# EAGLE design Adapter-IO4-test (EAGLE 7.7.0)
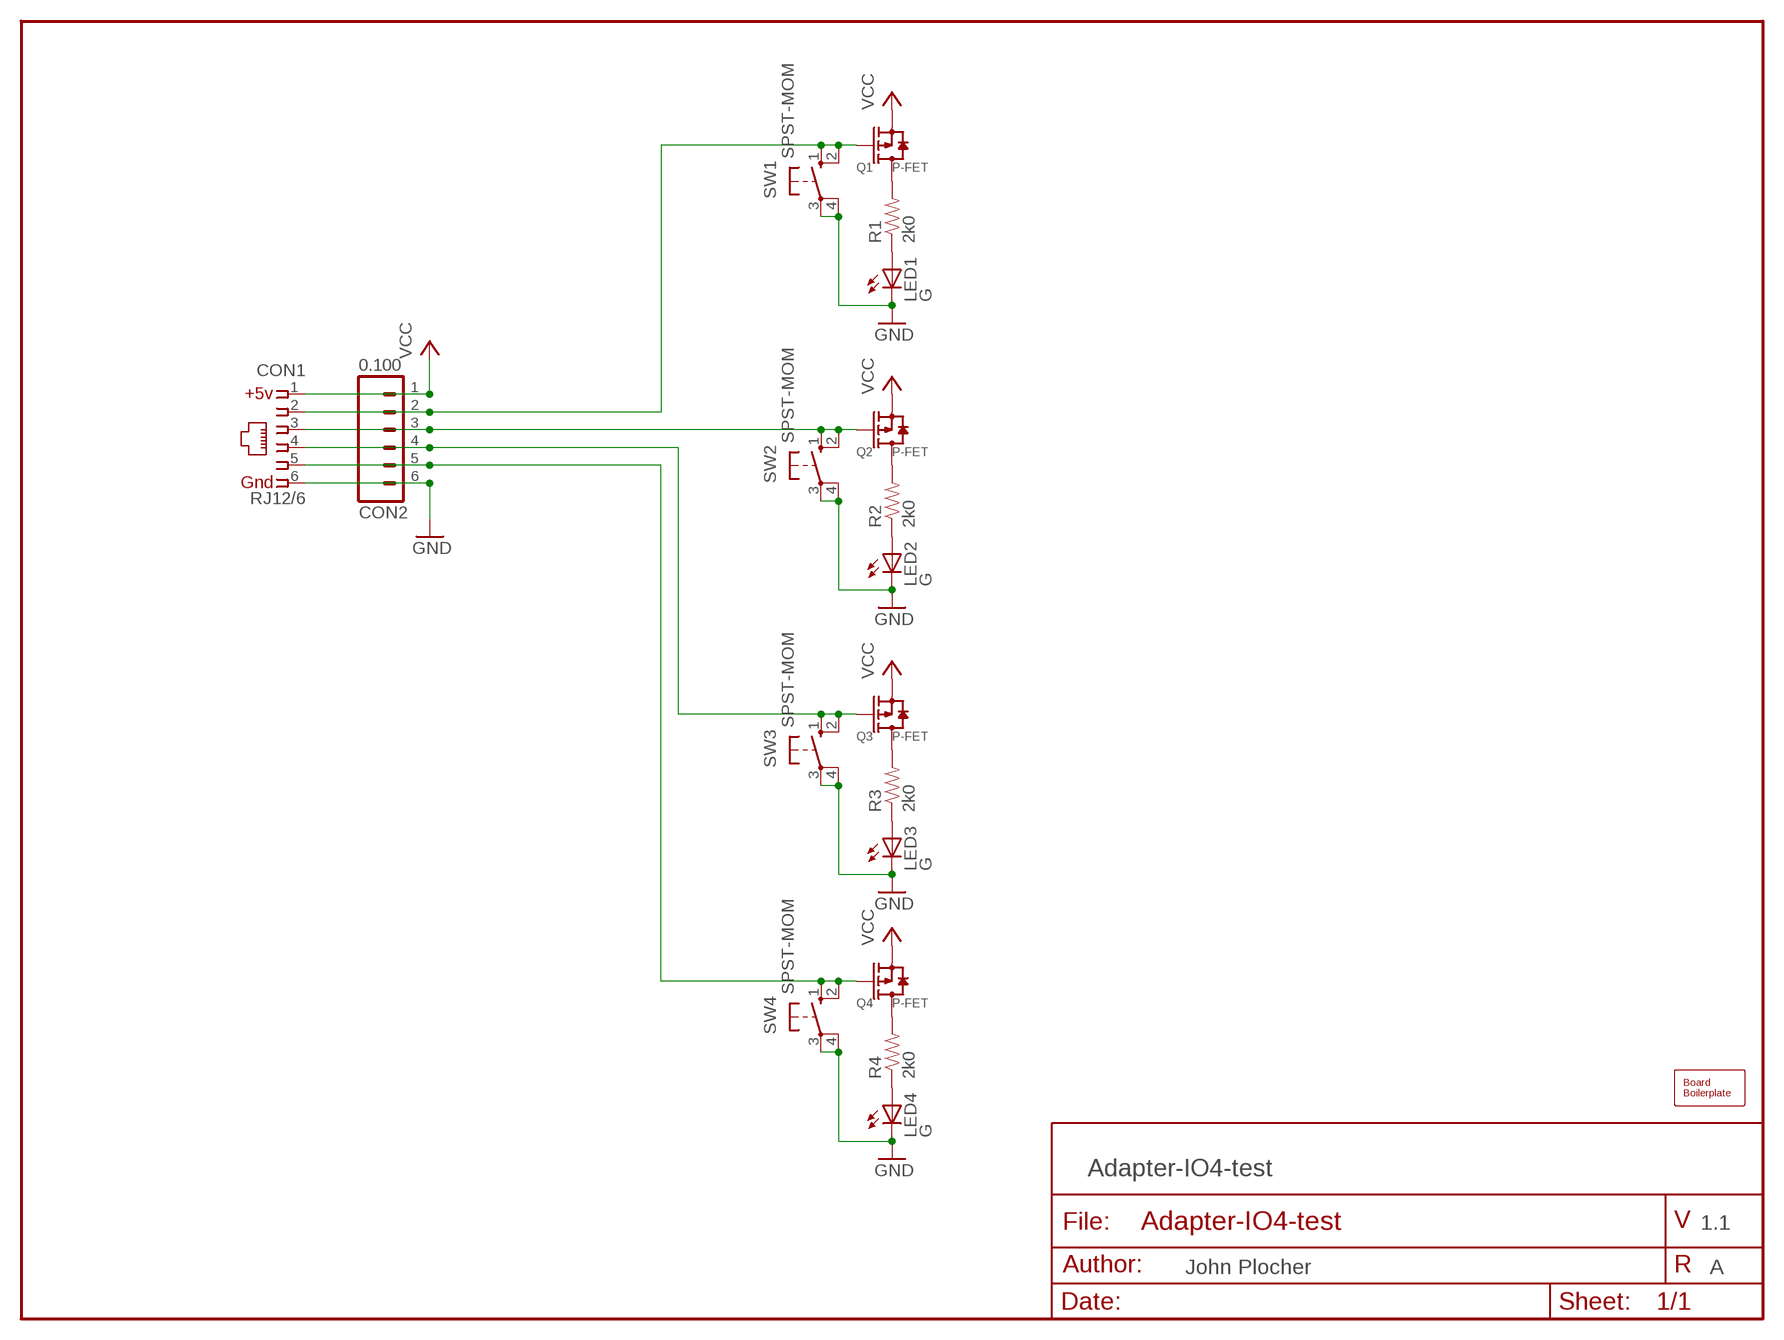
[diagram p0: schematic, sheet 1]

## Parts
BOARD1  BOARD50X50-NOHOLES  [BOARD-SEEED5X5-NOHOLES]
CON1  RJ12/6  CONNECTOR-IO4INV  [RJ25-INVERTED]
CON2  0.100  CONNECTOR-M06LOCK  [1X06_LOCK]
LED1  G  LED0603-LED  [0603-LED]
LED2  G  LED0603-LED  [0603-LED]
LED3  G  LED0603-LED  [0603-LED]
LED4  G  LED0603-LED  [0603-LED]
Q1  P-FET  MOSFET-P  [SOT23-3]
Q2  P-FET  MOSFET-P  [SOT23-3]
Q3  P-FET  MOSFET-P  [SOT23-3]
Q4  P-FET  MOSFET-P  [SOT23-3]
R1  2k0  R0603-RES  [0603-RES]
R2  2k0  R0603-RES  [0603-RES]
R3  2k0  R0603-RES  [0603-RES]
R4  2k0  R0603-RES  [0603-RES]
SW1  SPST-MOM  SWITCH-10-XX  [B3F-10XX]
SW2  SPST-MOM  SWITCH-10-XX  [B3F-10XX]
SW3  SPST-MOM  SWITCH-10-XX  [B3F-10XX]
SW4  SPST-MOM  SWITCH-10-XX  [B3F-10XX]

## Nets
GND: CON1.6 CON2.6 LED1.C LED2.C LED3.C LED4.C SW1.3(P) SW1.4(P1) SW2.3(P) SW2.4(P1) SW3.3(P) SW3.4(P1) SW4.3(P) SW4.4(P1)
N$1: Q1.3(D) R1.2
N$2: LED1.A R1.1
N$3: Q2.3(D) R2.2
N$4: LED2.A R2.1
N$5: Q3.3(D) R3.2
N$6: LED3.A R3.1
N$7: CON1.2 CON2.2 Q1.1(G) SW1.1(S) SW1.2(S1)
N$8: CON1.3 CON2.3 Q2.1(G) SW2.1(S) SW2.2(S1)
N$9: CON1.4 CON2.4 Q3.1(G) SW3.1(S) SW3.2(S1)
N$10: CON1.5 CON2.5 Q4.1(G) SW4.1(S) SW4.2(S1)
N$15: Q4.3(D) R4.2
N$16: LED4.A R4.1
VCC: CON1.1 CON2.1 Q1.2(S) Q2.2(S) Q3.2(S) Q4.2(S)

## Notes on the sheet
- 1.1
- John Plocher | A

## Library data of the parts
BOARD1 = SPCoast:BOARD
CON1 = SPCoast:CONNECTOR-IO4
CON2 = SPCoast:CONNECTOR-M06: Header 6 Standard 6-pin 0.1" header
LED1-LED4 = SPCoast:LED*
Q1-Q4 = SPCoast:MOSFET-P: CJ2305：SMD MOSFET P-CH 8V-4.1A
R1-R4 = SPCoast:R*: Resistor Basic schematic elements and footprints for 0603, 1206, and PTH 1/10th watt (small) resistors.
SW1-SW4 = SPCoast:SWITCH-10-XX: OMRON SWITCH

## Board
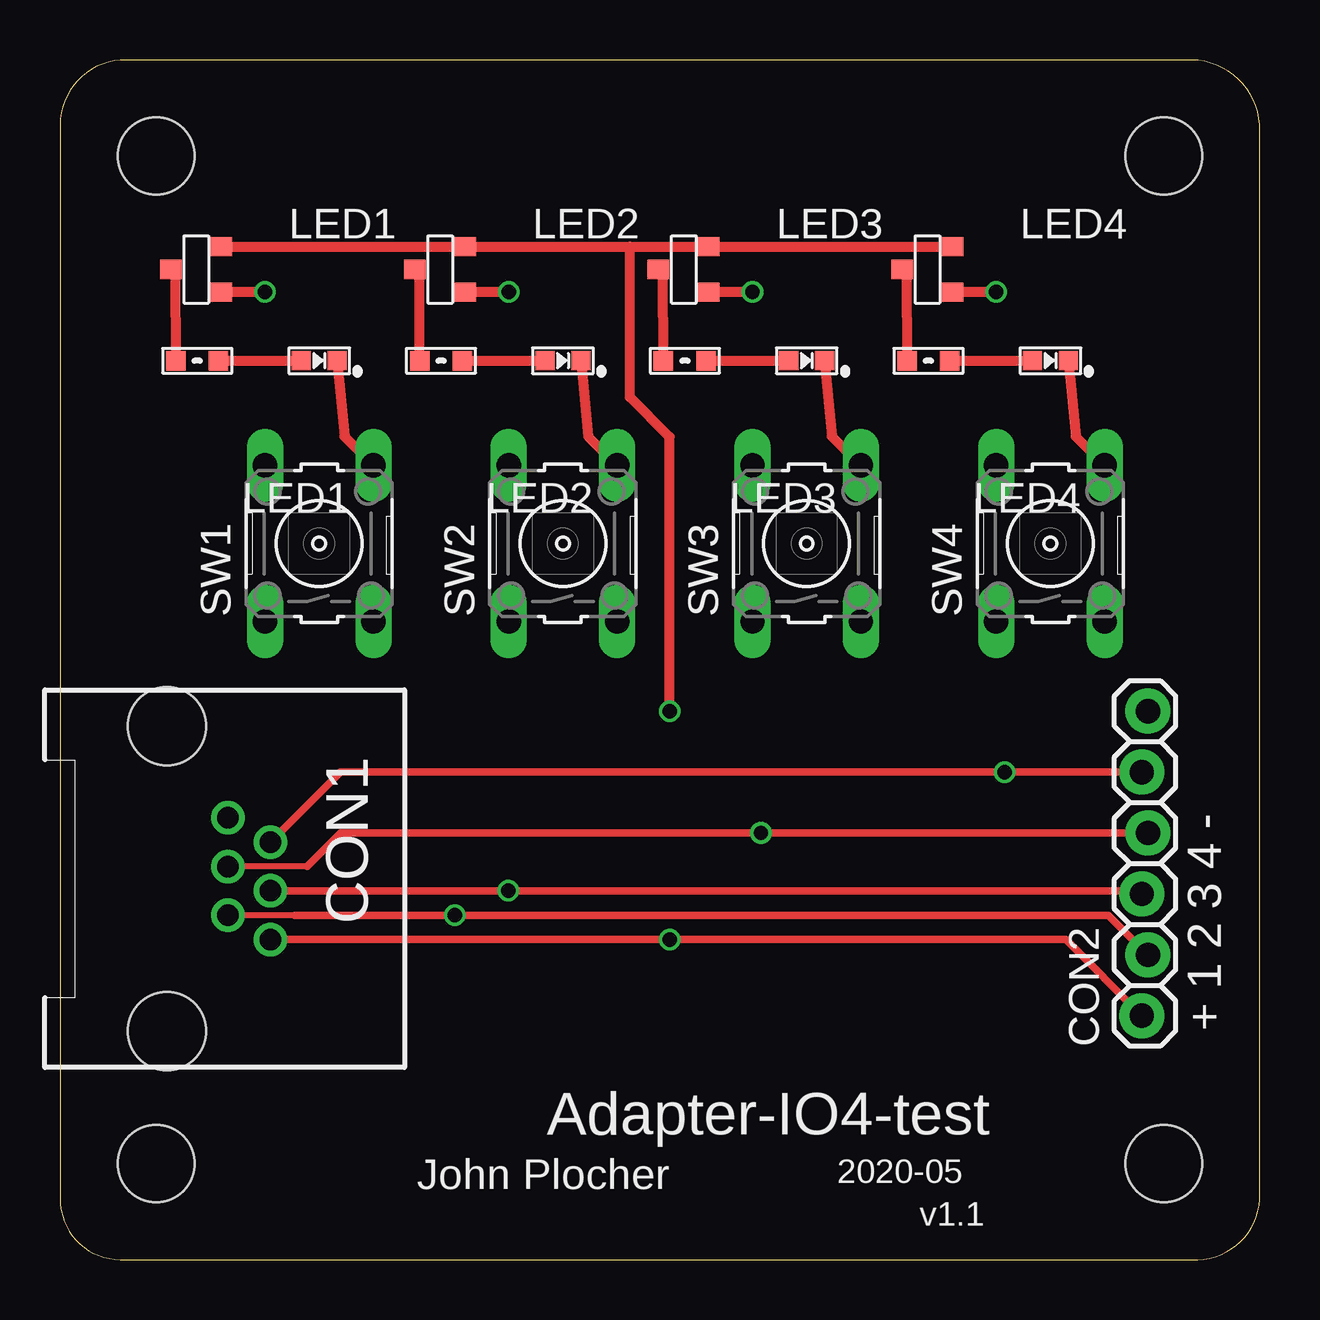
[diagram p1: board, top side]
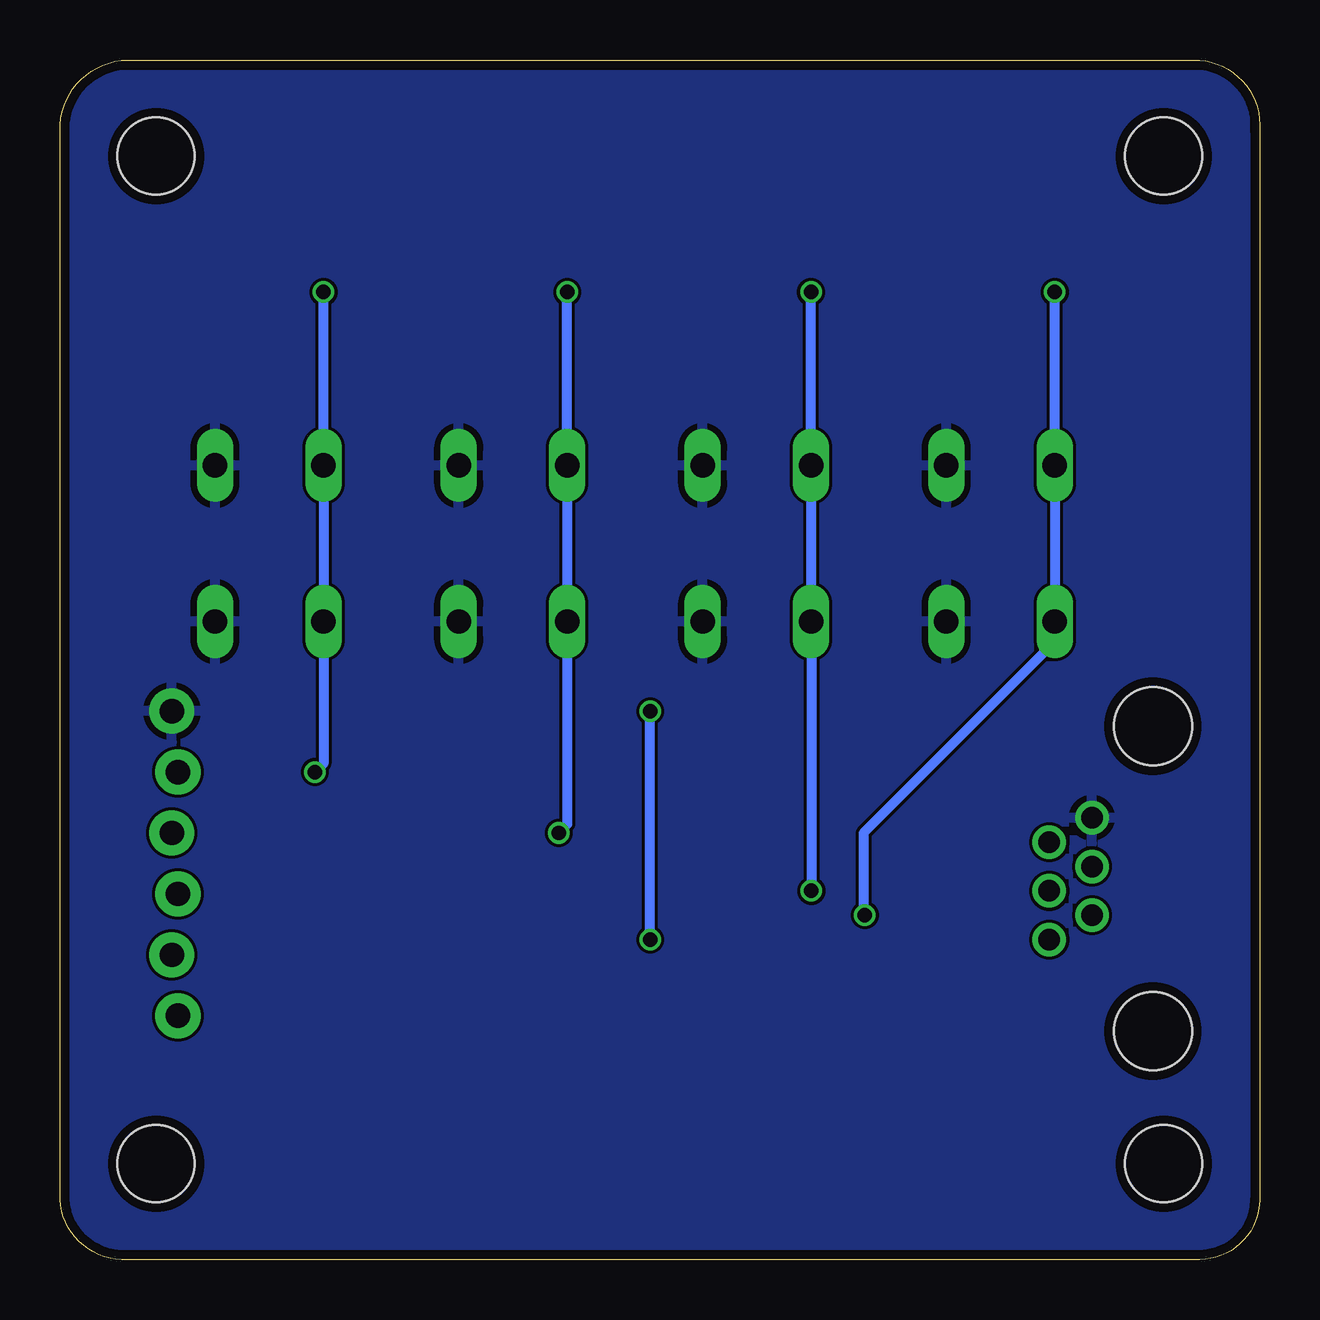
[diagram p2: board, bottom side, seen from below]

Size 50.01 x 50 mm. Coordinates in mm from the lower left corner, seen from the top.
Copper layers (1*16): Top 0.035mm / dielectric 1.5mm / Bottom 0.035mm
Design rules "default *": minimum track width 5mil, minimum drill 0.2mm, track to track 5mil, track to pad 5mil, pad to pad 5mil, via to via 5mil, smd to smd 5mil, copper to edge 0.4mm, drill to drill 5mil, minimum pad ring 3mil, minimum via ring 3mil, stop-mask expansion 4mil, vias tented up to drill 0mil, thermal gap 10mil
Holes 3.2 mm at 46.01,46 4.01,4 46.01,4 4.01,46

### Footprints (pad centres in the part's own frame; a part is rotated, then mirrored left to right if it is on the bottom)
RJ25-INVERTED = drill 0.9 pad 1.4: 1 2.54,4.318; 2 1.524,2.54; 3 0.508,4.318; 4 -0.508,2.54; 5 -1.524,4.318; 6 -2.54,2.54 | hole 3.251: -6.35,0; 6.35,0
1X06_LOCK = drill 1.016 pad 1.88: 1 0,0; 2 2.54,-0.254; 3 5.08,0; 4 7.62,-0.254; 5 10.16,0; 6 12.7,-0.254
0603-LED = smd 0.8 x 0.8: A 0.75,0; C -0.75,0
SOT23-3 = smd 0.9 x 0.8: 1 1,-0.95; 2 1,0.95; 3 -1.1,0
0603-RES = smd 0.813 x 0.813: 1 -0.889,0; 2 0.889,0
B3F-10XX = drill 1.016 long: 1 -3.251,2.261; 2 3.251,2.261; 3 -3.251,-2.261; 4 3.251,-2.261

### Placement (x,y rotation side)
BOARD1  0.01,0 0 top
CON1  4.45,15.88 270 top
CON2  45.09,10.16 90 top
LED1  10.8,37.47 180 top
LED2  20.96,37.47 180 top
LED3  31.12,37.47 180 top
LED4  41.28,37.47 180 top
Q1  5.72,41.28 0 top
Q2  15.88,41.28 0 top
Q3  26.04,41.28 0 top
Q4  36.2,41.28 0 top
R1  5.72,37.47 180 top
R2  15.88,37.47 180 top
R3  26.04,37.47 180 top
R4  36.2,37.47 180 top
SW1  10.8,29.85 90 top
SW2  20.96,29.85 90 top
SW3  31.12,29.85 90 top
SW4  41.28,29.85 90 top

### Tracks (layer width: path | path; a pad name or v marks a point on that pad's centre or on a via)
GND
  Top 0.406: LED1.C 11.85,34.31 SW1.4 | LED2.C 22.01,34.31 SW2.4 | LED3.C 32.17,34.31 SW3.4 | LED4.C 42.33,34.31 SW4.4
  pour Bottom: 0.01,50 0.01,0 50.01,0 50.01,50
N$1
  Top 0.406: R1.2 4.82,41.08 Q1.3
N$2
  Top 0.406: R1.1 LED1.A
N$3
  Top 0.406: R2.2 14.98,41.08 Q2.3
N$4
  Top 0.406: R2.1 LED2.A
N$5
  Top 0.406: R3.2 25.14,41.08 Q3.3
N$6
  Top 0.406: R3.1 LED3.A
N$7  (via drill 0.6)
  Top 0.254: 9.79,14.35 CON1.2
  Top 0.305: CON2.2 43.7,14.35 v16.46,14.35 9.79,14.35
  Top 0.406: v8.49,26.55 SW1.1 | v8.54,40.33 Q1.1
  Bottom 0.406: v8.54,40.33 SW1.2 SW1.1 | v8.49,26.55 8.49,25.81 16.52,17.78 16.52,14.41 v16.46,14.35
N$8  (via drill 0.6)
  Top 0.305: CON2.3 44.33,15.37 v18.69,15.37 CON1.3
  Top 0.406: v18.7,40.33 Q2.1
  Bottom 0.406: v18.7,40.33 SW2.2 SW2.1 v18.69,15.37
N$9  (via drill 0.6)
  Top 0.254: 10.3,16.39 CON1.4
  Top 0.305: CON2.4 v29.22,17.78 11.69,17.78 10.3,16.39
  Top 0.406: v28.86,40.33 Q3.1
  Bottom 0.406: v28.86,40.33 SW3.2 SW3.1 28.86,18.14 v29.22,17.78
N$10  (via drill 0.6)
  Top 0.305: CON1.5 11.69,20.32 v39.38,20.32 CON2.5
  Top 0.406: v39.02,40.33 Q4.1
  Bottom 0.406: v39.02,40.33 SW4.2 SW4.1 39.02,20.68 v39.38,20.32
N$15
  Top 0.406: R4.2 35.3,41.08 Q4.3
N$16
  Top 0.406: R4.1 LED4.A
VCC  (via drill 0.6)
  Top 0.305: CON2.1 41.92,13.34 v25.41,13.34 CON1.1
  Top 0.406: Q1.2 Q2.2 23.76,42.23 | 23.76,42.23 Q3.2 Q4.2 | v25.41,22.86 25.41,34.29 23.76,35.94 23.76,42.23
  Bottom 0.406: v25.41,13.34 v25.41,22.86

### Text on the board
tPlace: + 1 2 3 4 - | John Plocher | 2020-05 | v1.1
_tNames: LED1 | LED2 | LED3 | LED4 | SW1 | SW2 | SW3 | SW4 | CON1 | CON2